# EAGLE board Proj_v22 (EAGLE 9.6.0)
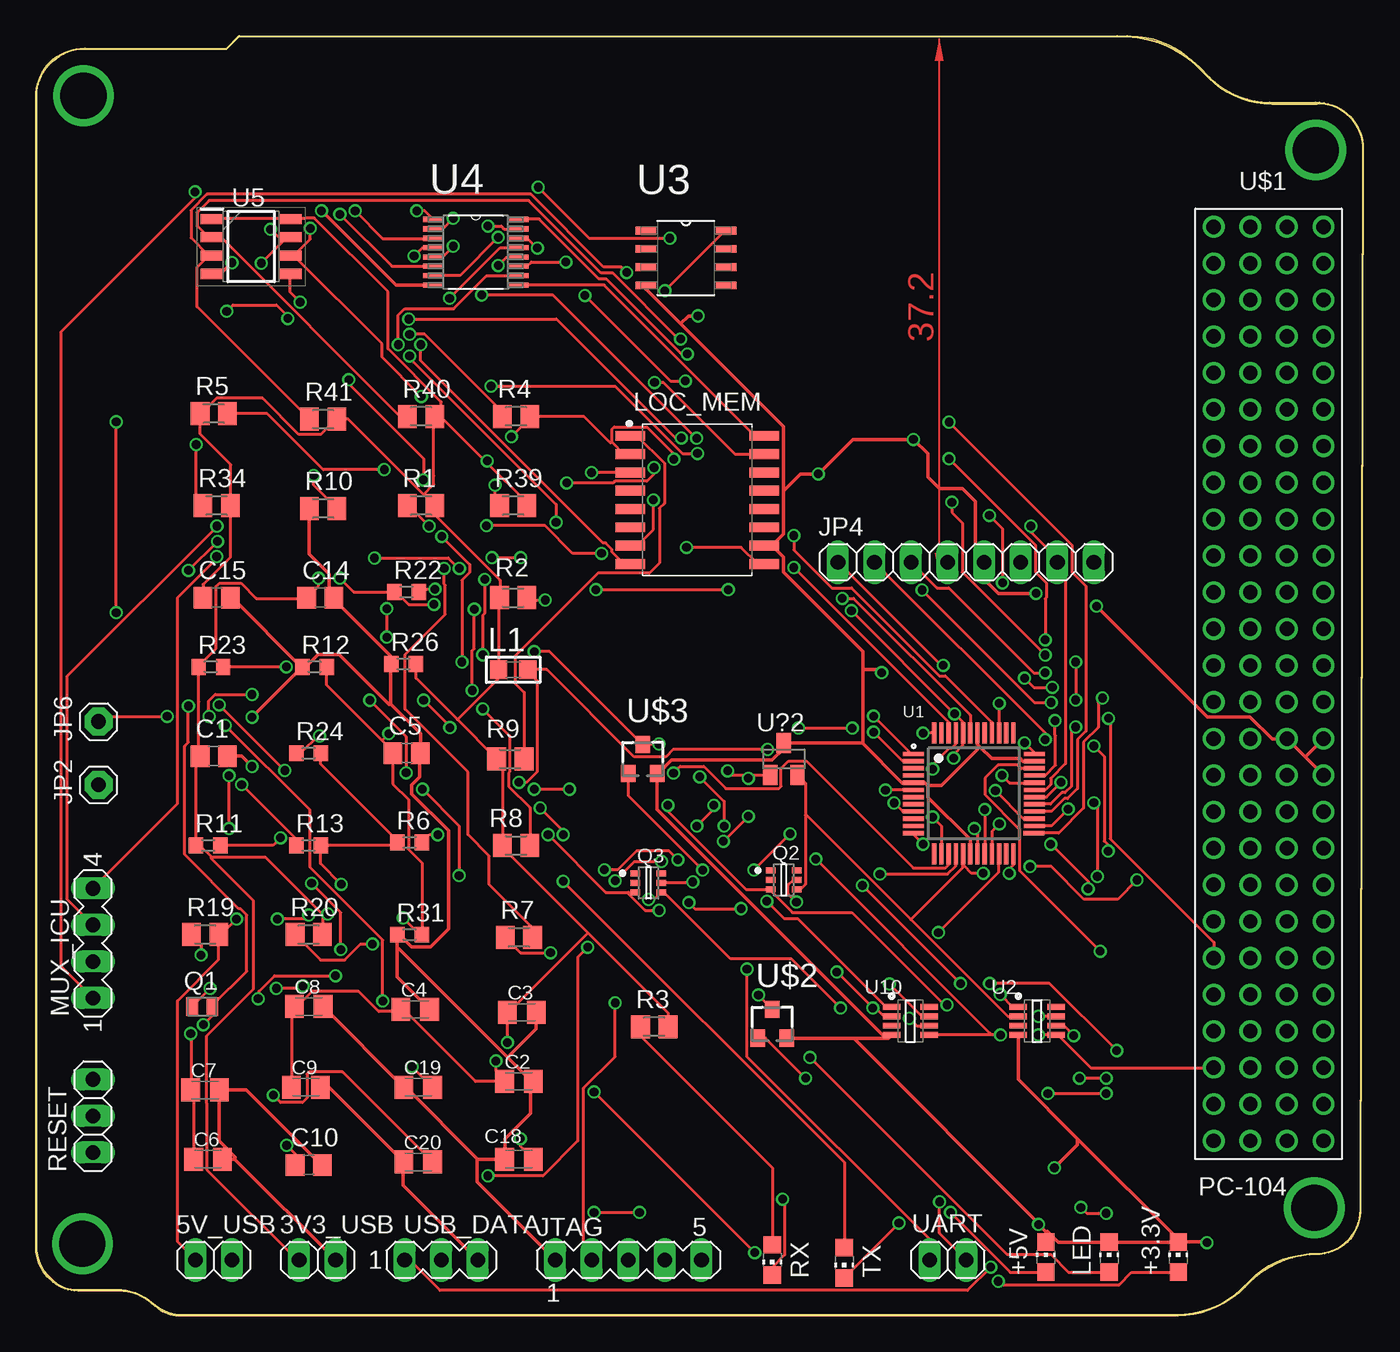
[diagram p1: board, top side]
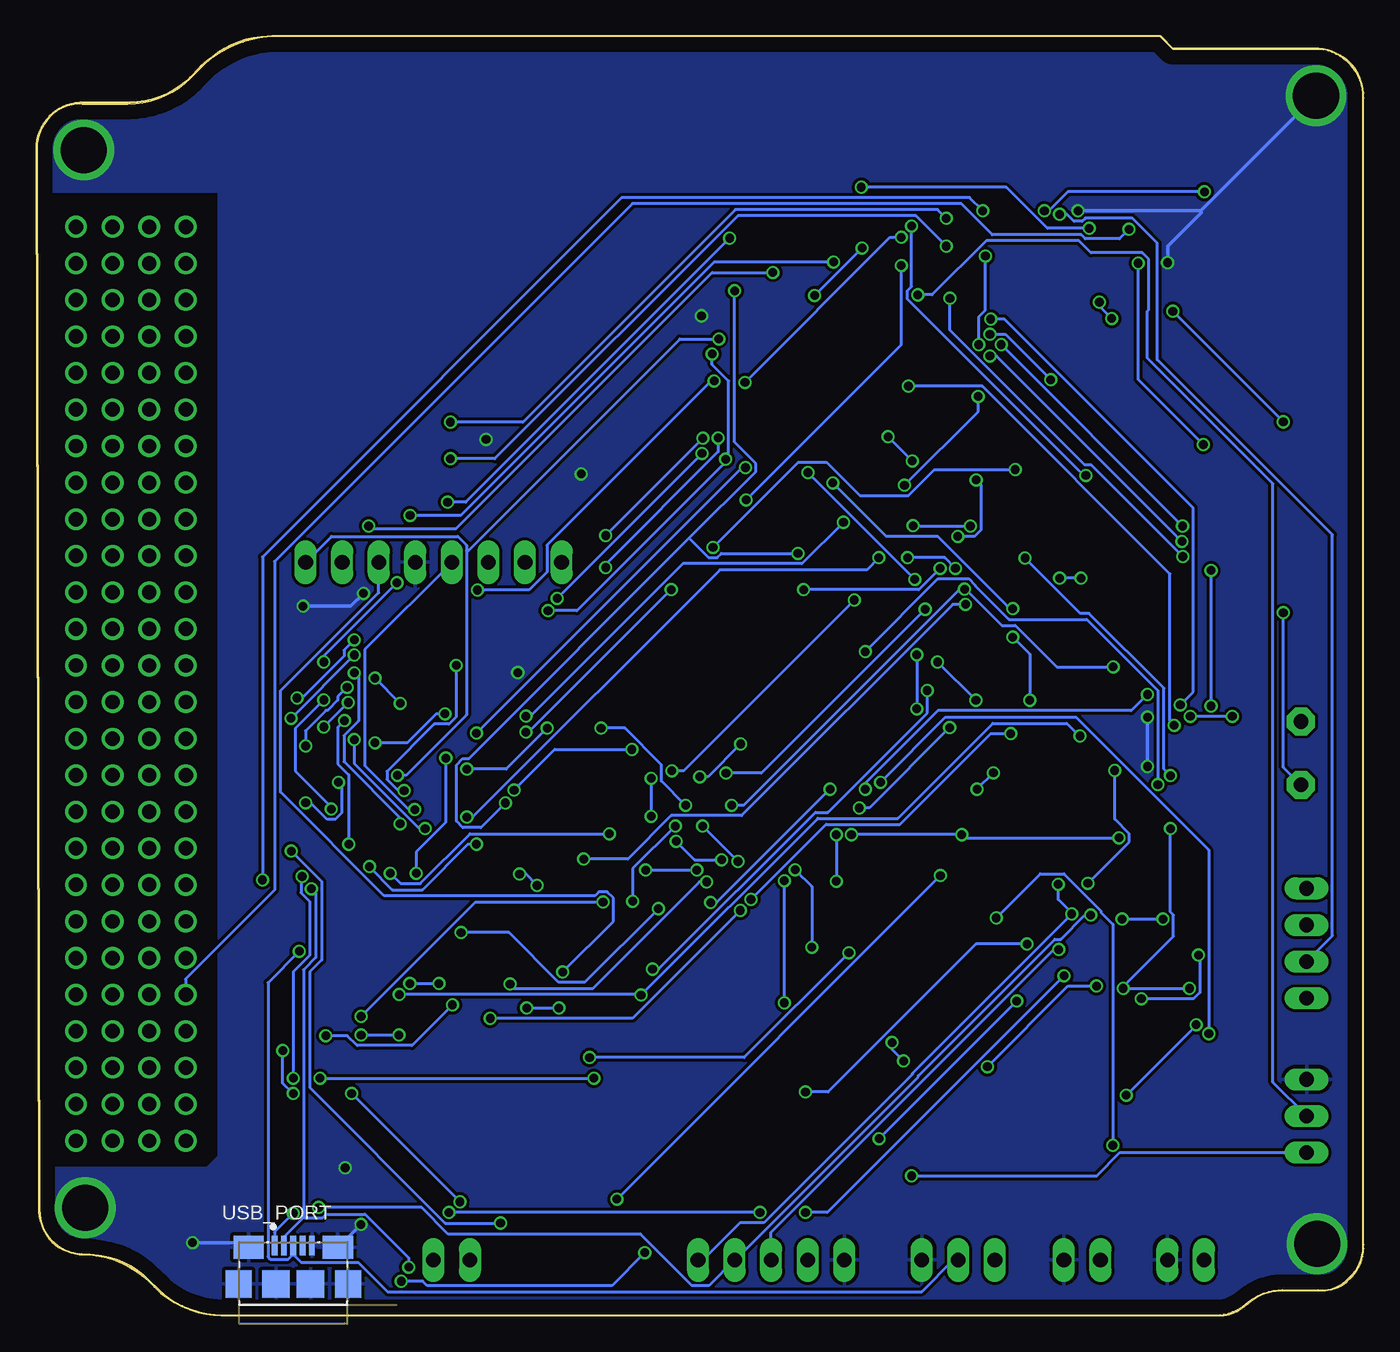
[diagram p2: board, bottom side, seen from below]

Size 92.22 x 88.9 mm. Coordinates in mm from the lower left corner, seen from the top.
Outline: 89.1,84.2 arc-90 92.22,81.05 92.02,7.52 arc-90 89,4.28 88.71,4.28 arc45 84.38,2.48 83.69,1.8 arc-45 79.36,0 9.88,0 arc-40 8.51,0.5 8.37,0.63 arc45 5.71,1.73 3.2,1.73 arc-90 0.05,4.83 0.05,84.83 arc-90 3.17,88 13.22,88 14.1,88.87 76.06,88.87 arc-45 80.39,87.08 81.5,85.97 arc45 85.84,84.18 89.02,84.18
Outline: 0,4.93 0,84.61 arc-90 3.41,88.03 13.25,88.03 14.12,88.9 75.11,88.9 arc-45 80.81,86.72 81.52,86.01 arc45 85.7,84.28 88.88,84.28 arc-90 92.17,81.13 92,7.66 arc-45 91.1,5.13 arc-35 89.21,4.28 89.05,4.28 arc45 84.27,2.3 83.98,2.01 arc-45 79.2,0.03 10.28,0.03 arc-41 8.04,0.87 arc41 5.62,1.78 3.15,1.78 arc-45 1.18,2.34 0.82,2.71 arc-45 0,4.93
Copper layers (1*16): Top 0.035mm / dielectric 1.5mm / Bottom 0.035mm
Design rules "default *": minimum track width 6mil, minimum drill 0.6mm, track to track 8mil, track to pad 6mil, pad to pad 6mil, via to via 6mil, smd to smd 6mil, copper to edge 40mil, drill to drill 6mil, minimum pad ring 10mil, minimum via ring 6mil, stop-mask expansion 4mil, vias tented up to drill 0mil, thermal gap 10mil
Net classes: 0 default: width 0.203 mm; 1 GND: width 0.254 mm

## Footprints (pad centres in the part's own frame; a part is rotated, then mirrored left to right if it is on the bottom)
1X02 = drill 1.016 long: 1 -1.27,0; 2 1.27,0
CHIP-LED0805 = smd 1.2 x 1.2: A 0,-1.05; C 0,1.05
C0805 = smd 1.3 x 1.5: 1 -0.95,0; 2 0.95,0
C0805K = smd 1.3 x 1.6: 1 -1,0; 2 1,0
1X01 = drill 1.016 pad 1.93 octagon: 1 0,0
1X08 = drill 1.016 long: 1 -8.89,0; 2 -6.35,0; 3 -3.81,0; 4 -1.27,0; 5 1.27,0; 6 3.81,0; 7 6.35,0; 8 8.89,0
MA05-1 = drill 1.016 long: 1 -5.08,0; 2 -2.54,0; 3 0,0; 4 2.54,0; 5 5.08,0
L0805 = smd 1.2 x 1.3: 1 -1.016,0; 2 1.016,0
SOIC127P1032X265-17T480X861N = smd 2.052 x 0.689: 1 -4.654,4.445; 2 -4.654,3.175; 3 -4.654,1.905; 4 -4.654,0.635; 5 -4.654,-0.635; 6 -4.654,-1.905; 7 -4.654,-3.175; 8 -4.654,-4.445; 9 4.654,4.445; 10 4.654,3.175; 11 4.654,1.905; 12 4.654,0.635; 13 4.654,-0.635; 14 4.654,-1.905; 15 4.654,-3.175; 16 4.654,-4.445
MA04-1 = drill 1.016 long: 1 -3.81,0; 2 -1.27,0; 3 1.27,0; 4 3.81,0
XTAL_ECS-.327-12.5-12QS-TR = smd 0.8 x 1.3: 1 -0.7,0; 2 0.7,0
VISHAY_SQ1922EEH-T1_GE3_0 = smd 0.66 x 0.406: 1 -0.902,0.66; 2 -0.902,0; 3 -0.902,-0.66; 4 0.902,-0.66; 5 0.902,0; 6 0.902,0.66
M0805 = smd 1.3 x 1.6: 1 -0.95,0; 2 0.95,0
R0603 = smd 1 x 1.1: 1 -0.85,0; 2 0.85,0
1X03 = drill 1.016 long: 1 -2.54,0; 2 0,0; 3 2.54,0
QFP50P900X900X120-48N = smd 1.45 x 0.3: 1 -4.2,2.75; 2 -4.2,2.25; 3 -4.2,1.75; 4 -4.2,1.25; 5 -4.2,0.75; 6 -4.2,0.25; 7 -4.2,-0.25; 8 -4.2,-0.75; 9 -4.2,-1.25; 10 -4.2,-1.75; 11 -4.2,-2.25; 12 -4.2,-2.75; 25 4.17,-2.75; 26 4.2,-2.25; 27 4.2,-1.75; 28 4.2,-1.25; 29 4.2,-0.75; 30 4.2,-0.25; 31 4.2,0.25; 32 4.2,0.75; 33 4.2,1.25; 34 4.2,1.75; 35 4.2,2.25; 36 4.2,2.75 | smd 0.3 x 1.45: 13 -2.75,-4.2; 14 -2.25,-4.2; 15 -1.75,-4.2; 16 -1.25,-4.2; 17 -0.75,-4.2; 18 -0.25,-4.2; 19 0.25,-4.2; 20 0.75,-4.2; 21 1.25,-4.2; 22 1.75,-4.2; 23 2.25,-4.2; 24 2.75,-4.2; 37 2.75,4.2; 38 2.25,4.2; 39 1.75,4.2; 40 1.25,4.2; 41 0.75,4.2; 42 0.25,4.2; 43 -0.25,4.2; 44 -0.75,4.2; 45 -1.25,4.2; 46 -1.75,4.2; 47 -2.25,4.2; 48 -2.75,4.2
LINEAR_TECHNOLOGY_LTC4361HTS8-1#TRMPBF_0 = smd 1.22 x 0.4: 1 -1.31,0.975; 2 -1.31,0.325; 3 -1.31,-0.325; 4 -1.31,-0.975; 5 1.31,-0.975; 6 1.31,-0.325; 7 1.31,0.325; 8 1.31,0.975
SOIC127P600X175-8N = smd 1.422 x 0.533: 1 -2.794,1.905; 2 -2.794,0.635; 3 -2.794,-0.635; 4 -2.794,-1.905; 5 2.794,-1.905; 6 2.794,-0.635; 7 2.794,0.635; 8 2.794,1.905
SOP65P640X120-16N = smd 1.473 x 0.356: 1 -2.921,2.286; 2 -2.921,1.626; 3 -2.921,0.965; 4 -2.921,0.33; 5 -2.921,-0.33; 6 -2.921,-0.965; 7 -2.921,-1.626; 8 -2.921,-2.286; 9 2.921,-2.286; 10 2.921,-1.626; 11 2.921,-0.965; 12 2.921,-0.33; 13 2.921,0.33; 14 2.921,0.965; 15 2.921,1.626; 16 2.921,2.286
SOIC127P600X175-8N' = smd 1.55 x 0.7: 1 -2.725,1.905; 2 -2.725,0.635; 3 -2.725,-0.635; 4 -2.725,-1.905; 5 2.725,-1.905; 6 2.725,-0.635; 7 2.725,0.635; 8 2.725,1.905
PC-104 = drill 1: P$1 -3.81,31.75; P$2 -1.27,31.75; P$3 -3.81,29.21; P$4 -1.27,29.21; P$5 -3.81,26.67; P$6 -1.27,26.67; P$7 -3.81,24.13; P$8 -1.27,24.13; P$9 -3.81,21.59; P$10 -1.27,21.59; P$11 -3.81,19.05; P$12 -1.27,19.05; P$13 -3.81,16.51; P$14 -1.27,16.51; P$15 -3.81,13.97; P$16 -1.27,13.97; P$17 -3.81,11.43; P$18 -1.27,11.43; P$19 -3.81,8.89; P$20 -1.27,8.89; P$21 -3.81,6.35; P$22 -1.27,6.35; P$23 -3.81,3.81; P$24 -1.27,3.81; P$25 -3.81,1.27; P$26 -1.27,1.27; P$27 -3.81,-1.27; P$28 -1.27,-1.27; P$29 -3.81,-3.81; P$30 -1.27,-3.81; P$31 -3.81,-6.35; P$32 -1.27,-6.35; P$33 -3.81,-8.89; P$34 -1.27,-8.89; P$35 -3.81,-11.43; P$36 -1.27,-11.43; P$37 -3.81,-13.97; P$38 -1.27,-13.97; P$39 -3.81,-16.51; P$40 -1.27,-16.51; P$41 -3.81,-19.05; P$42 -1.27,-19.05; P$43 -3.81,-21.59; P$44 -1.27,-21.59; P$45 -3.81,-24.13; P$46 -1.27,-24.13; P$47 -3.81,-26.67; P$48 -1.27,-26.67; P$49 -3.81,-29.21; P$50 -1.27,-29.21; P$51 -3.81,-31.75; P$52 -1.27,-31.75; P$53 1.27,31.75; P$54 3.81,31.75; P$55 1.27,29.21; P$56 3.81,29.21; P$57 1.27,26.67; P$58 3.81,26.67; P$59 1.27,24.13; P$60 3.81,24.13; P$61 1.27,21.59; P$62 3.81,21.59; P$63 1.27,19.05; P$64 3.81,19.05; P$65 1.27,16.51; P$66 3.81,16.51; P$67 1.27,13.97; P$68 3.81,13.97; P$69 1.27,11.43; P$70 3.81,11.43; P$71 1.27,8.89; P$72 3.81,8.89; P$73 1.27,6.35; P$74 3.81,6.35; P$75 1.27,3.81; P$76 3.81,3.81; P$77 1.27,1.27; P$78 3.81,1.27; P$79 1.27,-1.27; P$80 3.81,-1.27; P$81 1.27,-3.81; P$82 3.81,-3.81; P$83 1.27,-6.35; P$84 3.81,-6.35; P$85 1.27,-8.89; P$86 3.81,-8.89; P$87 1.27,-11.43; P$88 3.81,-11.43; P$89 1.27,-13.97; P$90 3.81,-13.97; P$91 1.27,-16.51; P$92 3.81,-16.51; P$93 1.27,-19.05; P$94 3.81,-19.05; P$95 1.27,-21.59; P$96 3.81,-21.59; P$97 1.27,-24.13; P$98 3.81,-24.13; P$99 1.27,-26.67; P$100 3.81,-26.67; P$101 1.27,-29.21; P$102 3.81,-29.21; P$103 1.27,-31.75; P$104 3.81,-31.75
DTC144EKA = smd 1 x 1.2: 1 1,-1; 2 -1,-1; 3 0,1
SOT23 = smd 1 x 1.4: 1 -0.95,-1.1; 2 0.95,-1.1; 3 0,1.1
MA03-1 = drill 1.016 long: 1 -2.54,0; 2 0,0; 3 2.54,0
AMPHENOL_10118192-0001LF = smd 0.4 x 1.35: 1 -1.3,0; 2 -0.65,0; 3 0,0; 4 0.65,0; 5 1.3,0 | smd 2.1 x 1.6: SH1 -3.1,-0.125; SH2 3.1,-0.125 | smd 1.8 x 1.9: SH3 -3.8,-2.675; SH6 3.8,-2.675 | smd 1.9 x 1.9: SH4 -1.2,-2.675; SH5 1.2,-2.675

## Placement (x,y rotation side)
3V3_USB  [1X02]  19.55,3.88 0 top
5V_USB  [1X02]  12.35,3.88 0 top
+3.3V  [CHIP-LED0805]  79.35,4.08 0 top
+5V  [CHIP-LED0805]  70.15,4.08 0 top
C1  47uF  [C0805]  12.35,38.88 0 top
C2  100nF  [C0805K]  33.55,16.28 0 top
C3  100nF  [C0805K]  33.75,21.08 0 top
C4  100nF  [C0805K]  26.35,21.28 0 top
C5  100nF  [C0805]  25.75,39.08 0 top
C6  100nF  [C0805K]  11.95,10.88 0 top
C7  10uF  [C0805K]  11.75,15.68 0 top
C8  0.1uF  [C0805K]  18.95,21.48 0 top
C9  10uF  [C0805K]  18.75,15.88 0 top
C10  100nF  [C0805]  18.95,10.48 0 top
C14  47uF  [C0805]  19.75,49.88 0 top
C15  100nF  [C0805]  12.55,49.88 0 top
C18  1uF  [C0805K]  33.55,10.88 180 top
C19  22pF  [C0805K]  26.55,15.88 0 top
C20  22pF  [C0805K]  26.55,10.68 0 top
JP2  [1X01]  4.35,36.88 90 top
JP4  [1X08]  64.6,52.35 0 top
JP6  [1X01]  4.35,41.28 90 top
JTAG  [MA05-1]  41.15,3.88 0 top
L1  10uH  [L0805]  33.15,44.88 0 top
LED  [CHIP-LED0805]  74.55,4.08 0 top
LOC_MEM  SOIC127P600X175-16NSOIC-16YAS  [SOIC127P1032X265-17T480X861N]  45.95,56.68 0 top
MUX_ICU  [MA04-1]  3.95,25.88 90 top
Q1  ECS-.327-12.5-12QS-TR  [XTAL_ECS-.327-12.5-12QS-TR]  11.55,21.48 0 top
Q2  VISHAY_SQ1922EEH-T1_GE3VISHAY_SQ1922EEH-T1_GE3_0_0  [VISHAY_SQ1922EEH-T1_GE3_0]  51.95,30.28 0 top
Q3  VISHAY_SQ1922EEH-T1_GE3VISHAY_SQ1922EEH-T1_GE3_0_0  [VISHAY_SQ1922EEH-T1_GE3_0]  42.55,30.08 0 top
R1  1K  [M0805]  26.75,56.28 0 top
R2  1K  [M0805]  33.15,49.88 180 top
R3  220  [M0805]  42.95,20.08 0 top
R4  220  [M0805]  33.35,62.48 0 top
R5  10K  [M0805]  12.35,62.68 0 top
R6  0.025  [R0603]  25.95,32.88 0 top
R7  220  [M0805]  33.55,26.28 0 top
R8  10K  [M0805]  33.35,32.68 180 top
R9  10K  [M0805]  32.95,38.68 180 top
R10  10K  [M0805]  19.95,56.08 0 top
R11  0.025  [R0603]  11.95,32.68 0 top
R12  100k  [R0603]  19.35,45.08 0 top
R13  10k  [R0603]  18.95,32.68 0 top
R19  1k  [M0805]  11.75,26.48 0 top
R20  1k  [M0805]  18.95,26.48 0 top
R22  0.025  [R0603]  25.75,50.28 0 top
R23  0.025  [R0603]  12.15,45.08 0 top
R24  10k  [R0603]  18.95,39.08 0 top
R26  100k  [R0603]  25.55,45.28 0 top
R31  100k  [R0603]  25.95,26.48 0 top
R34  10K  [M0805]  12.55,56.28 0 top
R39  10K  [M0805]  33.15,56.28 0 top
R40  10K  [M0805]  26.75,62.48 0 top
R41  10K  [M0805]  19.95,62.28 0 top
RESET  [1X03]  3.95,13.88 90 top
RX  [CHIP-LED0805]  51.15,3.88 180 top
TX  [CHIP-LED0805]  56.15,3.68 180 top
U1  ATSAMD21G18A-AF  [QFP50P900X900X120-48N]  65.15,36.28 0 top
U2  LINEAR_TECHNOLOGY_LTC4361HTS8-1#TRMPBFLINEAR_TECHNOLOGY_LTC4361HTS8-1#TRMPBF_0_0  [LINEAR_TECHNOLOGY_LTC4361HTS8-1#TRMPBF_0]  69.55,20.48 0 top
U3  LM335D  [SOIC127P600X175-8N]  45.15,73.48 0 top
U4  SN74CB3Q3257PW  [SOP65P640X120-16N]  30.55,73.88 0 top
U5  PCA9517AD  [SOIC127P600X175-8N']  14.95,74.28 0 top
U10  LINEAR_TECHNOLOGY_LTC4361HTS8-1#TRMPBFLINEAR_TECHNOLOGY_LTC4361HTS8-1#TRMPBF_0_0  [LINEAR_TECHNOLOGY_LTC4361HTS8-1#TRMPBF_0]  60.75,20.48 0 top
U$1  PC-104  [PC-104]  85.62,43.9 0 top
U$2  DTC144EKA  [DTC144EKA]  51.15,20.28 0 top
U$3  DTC144EKA  [DTC144EKA]  42.15,38.68 0 top
U?2  DS1818  [SOT23]  51.95,38.68 0 top
UART  [1X02]  63.35,3.88 180 top
USB_DATA  [MA03-1]  28.15,3.88 0 top
USB_PORT  [AMPHENOL_10118192-0001LF]  74.35,4.88 0 bottom

## Tracks (layer width: path | path; a pad name or v marks a point on that pad's centre or on a via)
+3V3  (via drill 0.6)
  Top 0.203: Q2.4 53.09,29.62 53.45,29.98 53.45,34.76 | 53.45,34.76 53.45,37.02 U?2.2 | 60.78,27.53 53.55,34.76 53.45,34.76 | 60.78,27.53 67.51,20.8 U2.2 | 64.39,31.24 64.39,31.14 60.78,27.53 | 64.39,31.24 U1.17 | U1.36 69.35,39.12 v68.67,39.8 | v45.25,66.82 44.83,66.82 39.63,72.02 39.11,72.02 34.95,76.18 33.49,76.18 U4.16 | v44.31,59.5 44.31,59.86 42.43,61.74 40.17,61.74 40.01,61.58 40.01,60.68 | 40.01,60.68 40.85,59.84 LOC_MEM.2 | 40.01,60.68 39.91,60.64 38.07,62.48 R4.2 34.27,62.38 34.27,62.3 v33.03,61.06 | v56.65,48.98 v63.81,41.82 64.41,41.22 U1.44 64.37,40.38 64.37,39.62 63.75,39 v63.75,38.74 | v65.81,30.74 64.99,30.74 64.49,31.24 64.39,31.24 | U5.1 17.65,76.2 U5.8 17.77,76.22 18.73,76.22 18.77,76.26 19.33,76.26 24.45,71.14 24.45,67.18 28.15,63.48 28.15,62.58 R40.2 | R40.2 28.11,62.48 31.28,59.31 | 31.28,59.31 34.11,56.48 R39.2 | C15.1 11.61,50.8 13.49,52.68 R34.2 13.53,56.38 13.53,59.12 11.39,61.26 R5.1 11.49,62.72 11.53,62.72 12.55,63.74 15.73,63.74 18.25,61.22 19.79,61.22 20.81,62.24 R41.2 21.69,62.28 26.92,57.05 | 26.92,57.05 R1.2 27.65,56.18 27.65,55.68 32.23,51.1 32.23,49.98 R2.2 32.15,49.84 32.15,44.88 L1.1 32.11,44.78 32.11,44.24 29.28,41.41 | C9.1 17.75,21.28 C8.1 18.05,21.52 18.17,21.52 19.19,22.54 22.41,22.54 23.81,21.14 25.15,21.14 25.25,21.24 C4.1 25.53,21.28 30.53,16.28 C2.1 32.59,16.38 31.95,17.02 v31.95,17.7 | v32.75,18.98 C3.1 32.85,21.12 38.34,26.61 | 29.28,41.41 R9.2 31.97,38.58 32.41,38.14 R8.2 32.37,32.58 38.34,26.61 | 29.28,41.41 26.39,44.3 R26.2 | 38.34,26.61 43.91,21.04 R3.2 | 26.92,57.05 27.63,57.76 27.63,58.34 27.61,58.36 27.61,62.42 R40.2
  Top 0.203: v31.35,59.38 31.28,59.31
  Bottom 0.203: v68.67,39.8 66.43,39.8 64.41,41.82 v63.81,41.82 | v45.25,66.82 45.25,66.08 44.11,64.94 44.11,59.7 v44.31,59.5 44.27,59.4 44.27,59.36 54.65,48.98 v56.65,48.98 | v65.81,30.74 65.81,32.22 63.75,34.28 v63.75,38.74 | v32.75,18.98 32.75,18.5 v31.95,17.7 | v31.35,59.38 v33.03,61.06
+3V3_CAM  (via drill 0.6)
  Top 0.203: 24.04,39.97 24.83,39.18 C5.1 24.79,36.96 25.87,35.88 25.87,32.4 26.81,31.46 R31.2 26.71,26.44 v25.51,27.64 | 24.04,39.97 20.19,43.82 R12.2 | v17.41,11.84 18.01,11.24 C10.1 | v55.89,21.38 52.47,24.8 48.25,24.8 43.63,29.42 Q3.4 43.37,29.36 42.93,28.92 v42.55,28.92 | U10.2 58.91,20.8 58.33,21.38 v58.13,21.38 v55.63,23.88 | v24.51,40.44 24.04,39.97
  Bottom 0.203: v17.41,11.84 17.41,27.2 18.23,28.02 18.23,28.12 20.81,30.7 22.45,30.7 v25.51,27.64 | v58.13,21.38 v55.89,21.38 | JP4.6 68.41,50.24 75.23,43.42 75.23,36.38 68.03,29.18 53.39,29.18 53.11,29.46 52.55,29.46 52.11,29.02 52.11,27.4 v55.63,23.88 | v24.51,40.44 25.89,40.44 32.19,34.14 37.33,34.14 v42.55,28.92
+3V3_H1-47  (via drill 0.6)
  Top 0.203: 66.27,19.52 66.99,19.52 v67.01,19.5 | 66.27,19.52 62.07,19.52 U10.5 | v69.63,19.5 U2.5 70.93,19.58 73.29,17.22 U$1.P$47 | R24.2 19.79,38.32 25.13,32.98 R6.1 24.89,32.68 R13.2 19.77,32.58 19.77,31.42 v21.21,29.98 | v21.11,51.24 22.07,50.28 R22.1 24.99,50.32 25.89,49.42 v27.65,49.42 | v19.63,51.24 19.63,50.7 C14.1 18.71,49.84 15.31,49.84 14.25,50.9 12.75,50.9 12.51,50.66 12.51,46.36 11.33,45.18 R23.1 11.29,42.66 11.31,42.64 11.31,39.1 11.43,38.98 C1.1 11.11,38.6 R11.1 11.21,32.86 12.21,31.86 | 19.91,27.88 R20.2 | 19.91,27.88 15.93,31.86 12.21,31.86 | 3V3_USB.1 18.13,3.88 11.87,10.14 11.87,14.74 11.83,14.78 11.83,19.42 15.07,22.66 15.07,28.86 12.17,31.76 12.21,31.86 | v20.27,27.92 20.01,27.92 19.91,27.88 | v54.17,31.72 66.27,19.62 66.27,19.52
  Bottom 0.203: v69.63,19.5 v67.01,19.5 | v19.63,51.24 v21.11,51.24 | JTAG.5 45.89,3.88 43.31,6.46 41.65,6.46 31.35,16.76 31.35,16.84 v20.27,27.92 20.31,28.02 21.21,28.92 v21.21,29.98 | v54.17,31.72 51.11,31.72 48.09,34.74 43.21,34.74 28.53,49.42 v27.65,49.42
+5V  (via drill 0.6)
  Top 0.203: 5V_USB.1 9.83,5.14 9.83,21.88 12.69,24.74 R19.2 12.79,26.52 12.89,26.52 v13.93,27.56 | v74.35,7.12 72.99,7.12 v72.59,7.52 | v16.77,27.56 18.67,27.56 v18.95,27.84
  Bottom 0.203: USB_PORT.1 75.65,5.82 v74.35,7.12 | v72.59,7.52 65.45,7.52 63.59,5.66 50.21,5.66 46.65,2.1 45.47,2.1 JTAG.4 43.61,3.92 30.93,16.6 30.93,16.68 21.45,26.16 21.03,26.16 19.35,27.84 v18.95,27.84 | v16.77,27.56 v13.93,27.56
CLK
  Top 0.203: U4.9 33.49,71.6 39.47,71.6 49.95,61.12 LOC_MEM.9
CS  (via drill 0.6)
  Top 0.203: v32.11,72.96 32.69,73.54 U4.12 | v42.89,56.68 42.89,54.62 41.79,53.52 LOC_MEM.7
  Bottom 0.203: v32.11,72.96 32.11,67.46 v42.89,56.68
D+  (via drill 0.6)
  Top 0.203: v73.93,25.32 68.33,30.92 68.33,33.8 65.93,36.2 65.93,37.36 66.83,38.26 68.21,38.26 68.45,38.02 U1.34
  Bottom 0.203: 74.35,4.28 USB_PORT.3 | 74.35,4.28 74.69,3.94 75.95,3.94 76.11,4.1 76.11,23.14 v73.93,25.32 | USB_DATA.2 28.49,3.88 30.69,1.68 67.81,1.68 69.83,3.7 73.79,3.7 74.29,4.2 74.35,4.28
D-  (via drill 0.6)
  Top 0.203: v73.09,29.66 73.09,30.16 v70.49,32.76 | v70.79,41.34 70.79,40.34 70.83,40.3 70.83,38.26 70.11,37.54 U1.33 | USB_DATA.1 25.95,3.88 28.07,1.76 64.71,1.76 v66.33,3.38
  Bottom 0.203: 73.63,6.84 75.01,5.46 USB_PORT.2 | 73.63,6.84 73.63,24.04 72.79,24.88 72.79,29.36 v73.09,29.66 | v70.49,32.76 70.49,37.58 71.25,38.34 71.25,40.88 v70.79,41.34 | v66.33,3.38 66.33,4.02 69.37,7.06 72.05,7.06 72.31,6.8 73.53,6.8 73.63,6.84
EN_I2C  (via drill 0.6)
  Top 0.203: v18.35,70.42 17.67,71.1 U5.5 | v17.49,69.28 17.49,69.44 16.71,70.22 13.69,70.22 v13.25,69.78 | v5.57,48.84 v5.57,62.1
  Bottom 0.203: v18.35,70.42 18.35,70.14 v17.49,69.28 | v5.57,62.1 v13.25,69.78 | v5.57,48.84 5.57,38.1 JP2.1
GND  (via drill 0.6, 3.2)
  Top 0.254: 65.57,39.52 66.39,38.7 68.39,38.7 68.57,38.52 U1.35 | 65.57,39.52 65.39,39.7 U1.42 | 57.41,39.78 U?2.3 51.91,39.66 51.91,39.38 51.13,38.6 44.15,38.6 43.27,37.72 U$3.1 43.15,35.16 58.91,19.4 U10.4 59.21,19.28 56.91,19.28 | 57.41,39.78 60.17,37.02 U1.5 61.07,37.08 61.69,37.08 61.97,36.8 | 61.97,36.8 61.97,36.02 64.91,33.08 U1.18 | 65.57,39.52 62.89,36.84 62.09,36.84 61.97,36.8 | 44.78,68.91 51.91,61.78 51.91,57.28 | 44.78,68.91 42.35,71.34 42.35,71.56 U3.4 | 51.91,57.28 51.91,54.3 51.13,53.52 LOC_MEM.15 51.19,53.42 51.91,52.7 51.91,51.68 57.45,46.14 57.45,44.88 | 57.45,44.88 57.45,39.9 57.41,39.78 | 56.91,19.28 U$2.1 | R12.1 18.43,45.08 13.63,49.88 C15.2 | C1.2 14.29,38.88 v15.01,38.16 | v15.01,41.58 18.39,44.96 R12.1 | 24.65,42.5 26.71,40.44 C5.2 26.65,38.96 26.65,37.42 26.11,36.88 26.11,36.26 28.65,33.72 28.65,26.88 27.41,25.64 26.11,25.64 25.21,26.54 R31.1 25.09,25.48 | 24.65,42.5 24.65,45.16 R26.1 24.71,45.76 20.69,49.78 C14.2 20.75,50 20.37,50.38 20.37,51.54 18.99,52.92 R10.1 | R12.1 18.61,45.14 18.81,45.14 19.59,45.92 21.07,45.92 24.53,42.46 24.65,42.5 | 25.09,25.48 25.09,23.54 C4.2 | 32.75,17.94 25.21,25.48 25.09,25.48 | 32.75,17.94 34.41,16.28 C2.2 34.37,16.16 34.37,14.06 32.59,12.28 32.59,11 C18.2 30.69,10.88 | C3.2 34.75,19.94 32.75,17.94 | C8.2 C19.1 25.67,15.9 30.69,10.88 | C10.2 19.81,10.48 14.61,15.68 C7.2 12.71,15.56 12.71,12.14 13.85,11 13.81,10.88 | C9.2 20.35,15.88 C20.1 25.51,10.56 25.51,9.06 USB_DATA.3 | 88.17,38.82 U$1.P$81 86.77,40.06 85.87,40.06 84.33,41.6 81.37,41.6 v73.67,49.3 | 88.17,38.82 U$1.P$84 | 88.17,38.82 U$1.P$82 | 70.15,5.84 +5V.C
  Top 0.254: 70.15,5.84 v69.65,6.34 69.61,6.46 56.91,19.16 56.91,19.28 | 70.15,5.84 70.27,5.88 71.03,5.12 LED.C 74.67,5.18 74.73,5.12 +3.3V.C | 72.36,12.29 79.41,5.24 +3.3V.C | 72.36,12.29 68.23,16.42 U2.4 | v19.83,76.76 25.01,71.58 27.61,71.58 U4.8 | v13.61,73.16 12.83,72.38 U5.4 | 13.81,10.88 C6.2 | 13.81,10.88 3V3_USB.2 | v69.47,50.18 66.85,50.18 65.87,51.16 JP4.5 65.27,52.95 65.27,56.56 64.35,57.48 62.75,57.48 61.95,58.28 61.95,59.88 v60.95,60.88 56.75,60.88 v54.35,58.48 53.11,58.48 51.91,57.28 | JTAG.1 30.65,9.3 30.65,10.76 30.69,10.88 | 44.78,68.91 45.33,69.46 v45.99,69.46 | 72.36,12.29 72.36,11.89 v70.75,10.28 | +3.3V.C 81.3,5.13 v81.35,5.08 | 57.45,44.88 58.55,44.88 v58.75,44.68
  Bottom 0.254: v15.01,41.58 v15.01,38.16 | v69.65,6.34 USB_PORT.SH2 | 11.31,76.76 v19.83,76.76 | 11.31,76.76 v3.31,84.76 v3.3,84.75 | v13.61,73.16 13.61,74.3 11.27,76.64 11.31,76.76 | v73.67,49.3 70.35,49.3 v69.47,50.18 | USB_PORT.SH1 77.78,5.08 v81.35,5.08
  other vias: 88.9,80.98 3.22,5 88.8,7.5
  pour Bottom: 0.35,90.88 89.15,90.88 94.15,85.88 94.15,79.48 93.15,78.48 92.75,78.08 79.55,78.08 79.55,11.08 80.35,10.28 92.55,10.28 93.15,9.68 93.15,4.48 92.95,4.28 86.75,-1.92 42.35,-1.92 2.75,-1.92 -1.85,2.68 -1.85,89.48 -0.65,90.68
I2C_SCL  (via drill 0.6)
  Top 0.203: v15.65,73.12 17.43,74.9 17.67,74.9 U5.7 17.09,74.68 v16.29,75.48 | v11.13,60.52 11.13,56.76 R34.1
  Bottom 0.203: v15.65,73.12 15.65,65.04 v11.13,60.52 | v16.29,75.48 16.95,74.82 19.33,74.82 19.61,75.1 25.79,75.1 27.95,77.26 50.79,77.26 75.65,52.4 75.65,29.58 81.83,23.4 81.83,22.32 U$1.P$43
I2C_SDA  (via drill 0.6)
  Top 0.203: v26.77,63.86 24.03,66.6 24.03,67.52 17.89,73.66 17.69,73.66 U5.6 17.97,73.72 19.05,74.8 v19.05,75.54 | v31.89,57.7 31.89,56.6 R39.1 | v74.51,41.5 74.63,41.38 74.63,33.14 81.83,25.94 81.83,24.86 U$1.P$41 | v70.11,45.9 64.35,51.66 64.35,55.08 63.63,55.8 v63.63,56.52 | v44.03,74.86 38.43,74.86 v34.89,78.4
  Bottom 0.203: v26.77,63.86 26.77,62.82 v31.89,57.7 | v70.11,45.9 v74.51,41.5 | v63.63,56.52 62.37,56.52 v44.03,74.86 | v34.89,78.4 24.81,78.4 21.95,75.54 v19.05,75.54
ICU_OCP_SESNSE1  (via drill 0.6)
  Top 0.203: v43.89,35.46 43.89,35.04 49.31,29.62 Q2.3 51.05,29.52 52.55,28.02 56.67,28.02 63.09,21.6 v63.29,21.6 | v27.71,50.48 26.81,50.48 R22.2 | v17.39,45.08 R23.2 | v72.09,19.46 71.39,20.16 U2.6
  Bottom 0.203: v43.89,35.46 43.07,35.46 28.05,50.48 v27.71,50.48 27.61,50.44 25.13,47.96 24.19,47.96 21.31,45.08 v17.39,45.08 | v72.09,19.46 70.59,19.46 69.91,18.78 66.11,18.78 v63.29,21.6
ICU_OCP_SESNSE3  (via drill 0.6)
  Top 0.203: 41.15,29.42 39.57,29.42 v35.57,33.42 | 41.15,29.42 Q3.3 | v27.91,33.42 27.35,33.42 R6.2 | R11.2 16.47,32.68 v16.99,33.2 | v60.67,20.66 61.19,20.14 62.05,20.14 U10.6 | v43.29,28.16 42.31,28.16 41.15,29.32 41.15,29.42
  Bottom 0.203: v35.57,33.42 v27.91,33.42 27.81,33.38 27.63,33.2 v16.99,33.2 | v60.67,20.66 50.79,20.66 v43.29,28.16
MISO  (via drill 0.6)
  Top 0.203: v26.27,73.62 26.85,74.2 27.61,74.2 U4.4 | v26.73,67.46 26.73,66.34 39.39,53.68 39.57,53.68 40.01,53.24 40.01,53.06 40.85,52.22 LOC_MEM.8
  Bottom 0.203: v26.27,73.62 26.27,69.86 26.73,69.4 v26.73,67.46
MISO_ICU  (via drill 0.6)
  Top 0.203: v22.17,76.76 24.09,74.84 27.61,74.84 U4.3 | v11.05,78.08 11.05,77.66 1.75,68.36 1.75,24.28 MUX_ICU.1
  Bottom 0.203: v22.17,76.76 21.87,76.76 20.55,78.08 v11.05,78.08
MISO_LOC  (via drill 0.6)
  Top 0.203: v66.93,34.18 66.41,33.66 U1.21 | v70.11,44.66 69.31,44.66 63.41,50.56 62.59,50.56 JP4.3
  Bottom 0.203: v66.93,34.18 66.93,34.6 70.83,38.5 70.83,40.3 69.81,41.32 69.81,44.36 v70.11,44.66
MISOLOC_MEM  (via drill 0.6)
  Top 0.203: v63.43,62.08 71.97,53.54 71.97,51.66 72.95,50.68 72.95,40.62 72.35,40.02 72.35,36.62 71.65,35.92 71.43,35.92 70.55,35.04 U1.28 | v28.99,76.24 28.27,75.52 U4.2
  Bottom 0.203: v63.43,62.08 58.39,62.08 43.63,76.84 29.59,76.84 v28.99,76.24
MOSI  (via drill 0.6)
  Top 0.203: v32.11,74.92 29.45,72.26 U4.7 | v42.97,64.84 43.59,64.84 48.59,59.84 LOC_MEM.10
  Bottom 0.203: v32.11,74.92 32.89,74.92 v42.97,64.84
MOSI_ICU  (via drill 0.6)
  Top 0.203: v21.11,76.52 24.73,72.9 27.61,72.9 U4.6
  Bottom 0.203: v21.11,76.52 20.59,76.52 20.11,76.04 19.55,76.04 19.33,76.26 16.07,76.26 14.33,74.52 14.33,66.42 2.17,54.26 2.17,26.4 MUX_ICU.2
MOSI_LOC  (via drill 0.6)
  Top 0.203: v65.19,33.84 65.41,33.62 U1.19 | v70.11,40.02 70.11,40.48 58.25,52.34 JP4.2
  Bottom 0.203: v65.19,33.84 65.59,33.84 70.11,38.36 v70.11,40.02
MOSILOC_MEM  (via drill 0.6)
  Top 0.203: v74.09,42.92 73.79,42.62 73.79,40.88 72.77,39.86 72.77,35.26 71.05,33.54 U1.25 | v70.11,46.96 70.11,49.82 70.19,49.9 70.19,50.9 69.43,51.66 69.43,53.54 v63.43,59.54 | v28.99,74.3 28.99,74.28 28.27,73.56 U4.5
  Bottom 0.203: v74.09,42.92 73.73,42.92 70.83,45.82 70.83,46.24 v70.11,46.96 | v63.43,59.54 60.35,59.54 43.47,76.42 31.11,76.42 v28.99,74.3
N$1  (via drill 0.6)
  Top 0.203: v11.63,20.22 12.25,20.84 Q1.2 12.29,21.58 14.65,23.94 14.65,27.84 14.21,28.28 14.09,28.28 10.33,32.04 10.33,39.58 10.59,39.84 v10.59,42.36 | v16.49,15.32 16.99,14.82 18.51,14.82 18.83,15.14 18.83,16.78 18.99,16.94 21.29,16.94 C20.2 | v58.19,41.66 60.83,39.02 U1.1 | v36.13,55.12 36.13,56.36 25.95,66.54 v25.95,66.68 | v10.59,51.78 v12.61,53.8
  Bottom 0.203: v11.63,20.22 11.63,20.18 v16.49,15.32 | v58.19,41.66 57.87,41.66 47.29,52.24 39.01,52.24 v36.13,55.12 | v25.95,66.68 25.49,66.68 v12.61,53.8 | v10.59,42.36 v10.59,51.78
N$2  (via drill 0.6)
  Top 0.203: R5.2 16.05,62.68 19.95,58.78 v24.19,58.78 | v45.19,53.38 48.99,53.38 50.15,52.22 LOC_MEM.16
  Bottom 0.203: v24.19,58.78 29.81,58.78 31.61,56.98 34.99,56.98 37.31,59.3 39.27,59.3 v45.19,53.38
N$3
  Top 0.203: R9.1 33.91,43.3 33.27,43.94 33.27,45.82 39.03,51.58 42.61,51.58 43.31,52.28 43.31,56.1 43.65,56.44 43.65,59.24 41.77,61.12 41.33,61.12 41.31,61.14 LOC_MEM.1
N$4  (via drill 0.6)
  Top 0.203: v31.03,42.16 32.91,40.28 32.91,37.78 32.83,37.7 32.83,36.78 34.31,35.3 R8.1 | v31.03,45.92 31.03,48.66 31.17,48.8 v31.17,51.16 | v38.59,58.58 LOC_MEM.3
  Bottom 0.203: v31.03,45.92 v31.03,42.16 | v38.59,58.58 v31.17,51.16
N$5  (via drill 0.6)
  Top 0.203: C6.1 10.95,15.48 C7.1 10.79,15.78 10.79,19.56 v10.75,19.6 | v50.83,39.34 44.27,39.34 43.75,38.82 41.55,38.82 35.49,44.88 L1.2 34.13,44.78 34.81,44.1 34.81,37.78 34.09,37.06 v33.55,37.06 | v59.01,36.52 U1.6
  Bottom 0.203: v50.83,39.34 56.19,39.34 v59.01,36.52 | v10.75,19.6 10.75,32.36 19.97,41.58 29.03,41.58 v33.55,37.06
N$6  (via drill 0.6)
  Top 0.203: v63.53,7.18 67.69,3.02 +5V.A | v38.77,7.18 v41.93,7.18 | v20.81,23.62 16.57,23.62 15.49,22.54 15.49,22.08 v15.43,22.02 | v11.47,25.06 11.47,25.8 R19.1
  Bottom 0.203: v41.93,7.18 v63.53,7.18 | v38.77,7.18 37.25,7.18 v20.81,23.62 | v15.43,22.02 11.81,22.02 11.37,22.46 11.37,24.96 v11.47,25.06
N$7  (via drill 0.6)
  Top 0.203: R24.1 18.39,39.08 19.59,40.28 v19.69,40.28 | v50.19,22.28 50.19,22.24 U$2.3 | v66.99,22.32 67.87,21.44 68.23,21.44 U2.1
  Bottom 0.203: v19.69,40.28 19.73,40.28 20.61,41.16 25.75,41.16 32.35,34.56 37.91,34.56 v50.19,22.28 50.29,22.32 v66.99,22.32
N$8  (via drill 0.6)
  Top 0.203: v66.85,2.4 67.09,2.16 75.25,2.16 76.11,3.02 +3.3V.A | v38.77,15.54 v49.93,4.38 | v23.37,25.82 22.55,25.82 21.45,24.72 19.77,24.72 R20.1
  Bottom 0.203: v66.85,2.4 65.35,2.4 65.05,2.1 52.21,2.1 v49.93,4.38 | v38.77,15.54 37.19,15.54 26.91,25.82 v23.37,25.82
N$9
  Top 0.203: RX.A 51.15,10.28 41.99,19.44 R3.1
N$10  (via drill 0.6)
  Top 0.203: v56.01,49.84 56.79,49.84 64.91,41.72 U1.43 | v45.95,59.9 44.91,59.9 40.23,64.58 v31.61,64.58 | v13.15,41.02 19.03,35.14 19.03,31.16 24.09,26.1 v24.09,21.86 | v33.65,12.3 33.65,11.78 C18.1
  Bottom 0.203: v45.95,59.9 v56.01,49.84 | v31.61,64.58 26.49,64.58 13.45,51.54 13.45,41.32 v13.15,41.02 | v33.65,12.3 v24.09,21.86
N$11  (via drill 0.6)
  Top 0.203: Q1.1 10.85,21.5 v12.09,22.74 | v16.69,22.74 18.39,22.74 v18.55,22.9 | C19.2 v26.13,17.3 | v58.19,40.54 60.21,38.52 U1.2 | v38.89,50.44 v48.09,50.44 | v29.41,51.92 29.35,51.92 28.63,52.64 v23.51,52.64 | v13.41,33.84 v13.41,37.52
  Bottom 0.203: v12.09,22.74 v16.69,22.74 16.73,22.84 13.21,26.36 13.21,27.84 13.41,28.04 v13.41,33.84 | v18.55,22.9 20.53,22.9 v26.13,17.3 | v58.19,40.54 57.99,40.54 v48.09,50.44 | v38.89,50.44 30.89,50.44 v29.41,51.92 | v23.51,52.64 19.67,48.8 19.07,48.8 13.87,43.6 13.87,37.98 v13.41,37.52
N$12  (via drill 0.6)
  Top 0.203: TX.A 56.15,10.66 v36.63,30.18 | v36.63,33.42 36.63,33.68 v35.03,35.28 | v28.75,40.86 28.75,40.94 v26.93,42.76 | v29.59,45.42 29.59,51.1 30.13,51.64 30.13,52.2 v28.19,54.14 | v26.91,58.06 26.91,59.56 21.73,64.74 v21.73,65.02 | v25.95,68.18 27.01,68.18 32.41,62.78 R4.1
  Bottom 0.203: v36.63,33.42 v36.63,30.18 | v35.03,35.28 34.33,35.28 v28.75,40.86 | v29.59,45.42 v26.93,42.76 | v28.19,54.14 27.03,54.14 26.59,54.58 26.59,57.74 v26.91,58.06 | v21.73,65.02 24.89,68.18 v25.95,68.18
N$13  (via drill 0.6)
  Top 0.203: v14.29,36.9 18.11,33.08 R13.1 | v34.61,46.14 35.69,46.14 U$3.3 42.25,39.72 v43.27,39.72 | v50.77,28.8 51.97,27.6 52.91,27.6 59.07,21.44 59.43,21.44 U10.1 | v47.81,34.02 47.81,35.74 v46.11,37.44
  Bottom 0.203: v14.29,36.9 14.29,43.44 19.23,48.38 24.63,48.38 26.99,50.74 26.99,50.76 27.43,51.2 29.55,51.2 v34.61,46.14 | v50.77,28.8 50.77,31.06 v47.81,34.02 | v46.11,37.44 45.55,37.44 v43.27,39.72
N$14  (via drill 0.6)
  Top 0.203: v53.77,17.94 67.45,4.26 70.49,4.26 71.73,3.02 LED.A | v35.75,25.22 33.67,25.22 R7.1
  Bottom 0.203: v53.77,17.94 43.03,17.94 v35.75,25.22
N$15  (via drill 0.6)
  Top 0.203: Q3.5 45.57,30.08 v45.63,30.14 | v59.29,23.04 61.53,20.8 U10.7
  Bottom 0.203: v45.63,30.14 46.13,30.14 53.53,22.74 58.99,22.74 v59.29,23.04
N$16  (via drill 0.6)
  Top 0.203: Q2.5 52.61,30.28 52.25,29.92 52.25,29.32 v52.83,28.74 | v69.63,20.8 U2.7
  Bottom 0.203: v52.83,28.74 61.69,28.74 v69.63,20.8
N$31  (via drill 0.6)
  Top 0.203: v31.39,75.7 32.33,75.7 32.53,75.5 U4.15 | v19.29,58.38 19.29,57.7 R10.2
  Bottom 0.203: v31.39,75.7 31.39,71.5 31.69,71.2 31.69,70.64 19.43,58.38 v19.29,58.38
OCP1  (via drill 0.6)
  Top 0.203: U$2.2 50.69,19.28 v53.47,16.5 | v74.35,16.5 v72.49,16.5 | v73.73,30.52 73.73,35.4 v73.49,35.64 | v71.21,37.06 70.19,36.04 U1.30
  Bottom 0.203: v72.49,16.5 v53.47,16.5 | v74.35,16.5 74.35,23.9 73.21,25.04 73.21,28.78 73.81,29.38 73.81,30.44 v73.73,30.52 | v73.49,35.64 73.15,35.64 71.99,34.48 71.43,34.48 70.99,34.92 70.99,36.84 v71.21,37.06
OCP3  (via drill 0.6)
  Top 0.203: U$3.2 41.15,36.12 v46.31,30.96 | v52.39,33.48 v49.87,30.96 | v67.61,30.74 67.61,31.04 67.89,31.32 U1.24
  Bottom 0.203: v49.87,30.96 v46.31,30.96 | v52.39,33.48 62.07,33.48 65.53,30.02 66.89,30.02 v67.61,30.74
PA09  (via drill 0.6)
  Top 0.203: v62.29,34.64 62.91,34.02 U1.14 | v31.67,52.66 v33.67,52.66 | v28.35,51.92 28.35,50.84 28.43,50.76 28.43,48.72 25.63,45.92 25.63,42.14 30.01,37.76 30.01,33.42 31.49,31.94 31.49,29.96 34.51,26.94 R7.2
  Bottom 0.203: v62.29,34.64 61.89,34.64 44.71,51.82 34.51,51.82 v33.67,52.66 | v31.67,52.66 29.09,52.66 v28.35,51.92
PA13  (via drill 0.6)
  Top 0.203: v62.69,26.62 66.89,30.82 U1.22 | v48.99,28.28 45.77,28.28 v45.35,28.7 | v34.61,36.58 v37.05,36.58 | v15.01,43.16 12.45,43.16 12.01,42.72 12.01,41.66 v12.03,41.64 | v9.11,41.64 4.71,41.64 JP6.1
  Bottom 0.203: v62.69,26.62 59.37,26.62 55.91,23.16 54.11,23.16 v48.99,28.28 | v45.35,28.7 44.93,28.7 v37.05,36.58 | v34.61,36.58 34.61,37 29.57,42.04 16.13,42.04 v15.01,43.16 | v9.11,41.64 v12.03,41.64
RESET  (via drill 0.6)
  Top 0.203: v52.65,54.2 52.65,53.2 55.29,50.56 56.65,50.56 62.75,44.46 63.17,44.46 66.41,41.22 U1.40 | v45.89,60.96 45.85,60.96 35.89,70.92 v30.97,70.92
  Bottom 0.203: v45.89,60.96 v52.65,54.2 | v30.97,70.92 29.97,70.92 26.21,74.68 19.77,74.68 18.93,73.84 15.37,73.84 14.93,73.4 14.93,69.88 15.03,69.78 15.03,66.54 6.29,57.8 6.29,16.22 RESET.2
RESET_LOC  (via drill 0.6)
  Top 0.203: 49.35,37.58 48.33,37.58 v48.05,37.86 | 49.35,37.58 U?2.1 | v35.37,49.72 34.27,49.72 R2.1 | v31.39,9.72 35.21,9.72 37.63,12.14 37.63,24.9 v38.33,25.6 | v39.49,30.98 40.41,30.98 41.71,32.28 43.99,32.28 v44.59,31.68 | v49.49,34.7 v47.75,32.96 | v49.49,37.34 49.35,37.48 49.35,37.58
  Bottom 0.203: v48.05,37.86 47.23,37.86 v35.37,49.72 | RESET.1 16.91,11.34 18.53,9.72 v31.39,9.72 | v38.33,25.6 38.33,29.82 v39.49,30.98 | v44.59,31.68 46.47,31.68 v47.75,32.96 | v49.49,37.34 v49.49,34.7
RX_LED  (via drill 0.6)
  Top 0.203: RX.C 51.15,3.36 52.01,4.22 52.01,7.96 v51.87,8.1 | v29.39,30.58 29.39,34.04 v26.85,36.58 | v25.71,37.72 25.71,40.24 v23.19,42.76 | v24.37,49.12 v24.37,47.14 | v36.87,57.86 40.11,57.86 40.23,57.98 42.43,57.98 42.93,58.48 v42.93,58.92 | U1.48 v61.63,40.48
  Bottom 0.203: v29.39,30.58 v51.87,8.1 | v25.71,37.72 v26.85,36.58 | v23.19,42.76 23.19,45.96 v24.37,47.14 | v24.37,49.12 24.55,49.12 29.59,54.16 33.17,54.16 v36.87,57.86 | v42.93,58.92 43.19,58.92 v61.63,40.48
RXI  (via drill 0.6)
  Top 0.203: v58.63,30.68 63.33,30.68 63.89,31.24 U1.16 | v64.23,23.08 v57.41,29.9 | v66.25,23.08 70.41,23.08 v75.07,18.42 | v70.29,15.44 v74.35,15.44 | v62.77,7.92 62.77,5.74 UART.1
  Bottom 0.203: v58.63,30.68 58.19,30.68 v57.41,29.9 | v66.25,23.08 v64.23,23.08 | v75.07,18.42 75.07,16.16 v74.35,15.44 | v62.77,7.92 v70.29,15.44
SCK_ICU  (via drill 0.6)
  Top 0.203: v25.17,67.46 25.17,69.52 25.61,69.96 29.01,69.96 31.29,72.24 U4.10 | v12.57,54.86 12.57,54.84 2.17,44.44 2.17,28.94 MUX_ICU.3
  Bottom 0.203: v12.57,54.86 v25.17,67.46
SCK_LOC  (via drill 0.6)
  Top 0.203: v65.91,35.16 U1.20
  Bottom 0.203: v65.91,35.16 66.33,35.16 69.39,38.22 69.39,46.28 63.33,52.34 JP4.4
SCKLOC_MEM  (via drill 0.6)
  Top 0.203: v71.71,35.2 70.55,34.04 U1.26 | v72.23,45.42 v72.23,42.78 | v67.15,50.92 67.15,54.68 v66.23,55.6 | v36.81,73.2 34.41,73.2 34.13,72.92 33.49,72.92 U4.11
  Bottom 0.203: v71.71,35.2 71.71,35.36 74.21,37.86 74.21,40.8 v72.23,42.78 | v72.23,45.42 72.23,45.84 v67.15,50.92 | v66.23,55.6 62.71,55.6 45.11,73.2 v36.81,73.2
SCL0_LOC  (via drill 0.6)
  Top 0.203: R40.1 25.29,62.48 12.85,74.92 U5.2 12.13,74.88 12.03,74.88 11.19,75.72 11.19,76.64 12.03,77.48 34.23,77.48 39.27,72.44 40.07,72.44 44.65,67.86 v44.79,67.86 | v67.11,37.54 67.63,37.02 U1.32
  Bottom 0.203: v67.11,37.54 66.51,37.54 62.31,41.74 62.31,53.14 | 62.31,53.14 62.31,53.54 62.91,54.14 71.69,54.14 73.49,52.34 JP4.8 | v44.79,67.86 47.49,67.86 62.21,53.14 62.31,53.14
SDA0_LOC  (via drill 0.6)
  Top 0.203: R41.1 11.19,70.1 11.19,72.84 11.99,73.64 12.21,73.64 U5.3 11.93,73.72 10.77,74.88 10.77,76.8 11.87,77.9 34.39,77.9 39.43,72.86 40.65,72.86 v41.03,72.48 | U1.31 70.11,36.54 70.49,36.92 70.49,37.34 71.51,38.36 71.51,51.78 70.95,52.34 JP4.7 70.99,52.44 70.99,52.56 69.11,54.44 v69.11,54.86
  Bottom 0.203: v41.03,72.48 45.25,72.48 63.05,54.68 68.93,54.68 v69.11,54.86
SELECTOR  (via drill 0.6)
  Top 0.203: U1.12 60.95,33.44 v61.63,32.76 | v69.05,31.2 70.55,31.2 72.81,28.94 75.15,28.94 v76.49,30.28 | v26.45,76.76 27.01,76.76 27.61,76.16 U4.1
  Bottom 0.203: v61.63,32.76 62.21,32.76 65.37,29.6 67.47,29.6 69.05,31.18 v69.05,31.2 | v76.49,30.28 76.49,52.72 51.53,77.68 27.37,77.68 v26.45,76.76
SS0_LOC  (via drill 0.6)
  Top 0.203: v66.65,36.48 68.61,34.52 U1.27 | v63.03,45.18 62.89,45.18 JP4.1
  Bottom 0.203: v66.65,36.48 67.05,36.48 67.83,37.26 67.83,37.82 64.55,41.1 63.53,41.1 63.03,41.6 v63.03,45.18
SS1LOC_MEM  (via drill 0.6)
  Top 0.203: v72.23,40.9 71.93,40.6 71.93,36.78 71.49,36.34 71.27,36.34 70.47,35.54 U1.29 | v70.53,42.6 69.37,42.6 v61.55,50.42 | v45.11,64.94 44.07,64.94 v38.13,70.88 | v34.83,74.18 34.79,74.18 34.11,74.86 33.49,74.86 U4.14
  Bottom 0.203: v70.53,42.6 v72.23,40.9 | v61.55,50.42 57.97,50.42 56.73,51.66 56.73,53.54 45.33,64.94 v45.11,64.94 | v34.83,74.18 v38.13,70.88
SS_ICU  (via drill 0.6)
  Top 0.203: v28.73,70.68 32.25,74.2 U4.13 | v12.55,52.74 12.55,52.6 9.83,49.88 9.83,35.58 MUX_ICU.4
  Bottom 0.203: v28.73,70.68 28.73,68.46 19.37,59.1 18.91,59.1 v12.55,52.74
SWCLK  (via drill 0.6)
  Top 0.203: v62.29,37.98 62.29,38.28 63.47,39.46 63.63,39.46 63.89,39.72 U1.45 | v52.97,40.82 v56.71,40.82 | v47.09,35.46 47.09,35.2 v45.91,34.02 | v43.45,31.56 41.57,31.56 v40.23,30.22 | v40.23,21.74 40.23,18 38.05,15.82 38.05,4.44 JTAG.2
  Bottom 0.203: v62.29,37.98 59.55,37.98 v56.71,40.82 | v52.97,40.82 51.31,40.82 48.77,38.28 48.77,37.14 v47.09,35.46 | v43.45,31.56 v45.91,34.02 | v40.23,21.74 v40.23,30.22
SWDIO  (via drill 0.6)
  Top 0.203: v52.65,51.98 63.41,41.22 U1.46 | v44.83,60.98 44.41,60.98 36.15,69.24 v25.89,69.24 | v17.29,37.88 v12.73,42.44 | v19.15,30.04 21.17,28.02 v21.17,25.44
  Bottom 0.203: v52.65,51.98 52.65,52.2 44.83,60.02 v44.83,60.98 | v25.89,69.24 24.95,69.24 11.83,56.12 11.83,43.34 v12.73,42.44 | v17.29,37.88 17.29,34.5 16.27,33.48 16.27,32.92 v19.15,30.04 | v21.17,25.44 21.51,25.44 41.15,5.8 JTAG.3
THERM_OUT_2  (via drill 0.6)
  Top 0.203: v43.69,71.2 47.87,75.38 U3.8 | v59.61,35.62 60.21,35.02 U1.9 | R1.1 25.89,56.28 v27.31,54.86 | v31.29,54.88 35.37,54.88 37.29,52.96 v39.29,52.96
  Bottom 0.203: v43.69,71.2 43.69,60.68 42.21,59.2 42.21,58.64 46.84,54.01 | 46.84,54.01 62.15,38.7 62.57,38.7 63.01,38.26 63.01,34.36 62.57,33.92 61.31,33.92 v59.61,35.62 | v27.31,54.86 31.27,54.86 v31.29,54.88 | v39.29,52.96 44.61,52.96 44.91,52.66 45.49,52.66 46.84,54.01
TX_LED  (via drill 0.6)
  Top 0.203: v59.95,6.44 TX.C | v74.49,32.28 74.49,32.7 74.21,32.98 74.21,38.86 v73.49,39.58 | v70.61,43.66 69.31,43.66 v68.67,44.3 | v66.91,42.54 U1.39
  Bottom 0.203: v59.95,6.44 63.79,6.44 73.21,15.86 73.21,23.88 72.37,24.72 72.37,30.16 v74.49,32.28 | v73.49,39.58 73.49,40.64 72.07,42.06 71.95,42.06 71.25,42.76 71.25,43.02 v70.61,43.66 | v66.91,42.54 v68.67,44.3
TXO  (via drill 0.6)
  Top 0.203: v44.29,37.7 44.75,38.16 46.39,38.16 47.93,36.62 51.61,36.62 51.77,36.78 51.77,38.02 52.29,38.54 53.51,38.54 60.95,31.1 63.17,31.1 63.39,31.32 U1.15 | v30.45,49.08 30.45,46.34 30.31,46.2 v30.31,43.44 | v49.39,24.08 49.39,18 62.09,5.3 UART.2
  Bottom 0.203: v44.29,37.7 41.83,37.7 v30.45,49.08 | v30.31,43.44 30.31,41.88 37.21,34.98 38.07,34.98 48.97,24.08 v49.39,24.08
(copper drawn outside any net)
  shapes: Top area x1

## Text on the board
bTest: VBAT | 5V | SCL | 3.3V | SDA | CAN_HIGH | 5V | GND | 3.3v | SDA | GND | CAN_HIGH | CAN_LOW | GND | SDL | CAN_LOW | 5V
Name: LOCANA + ICU BOARD